# Altium schematic sheet DM1097_TopLevel.SchDoc: =project_title
size Tabloid; PageSetup: Record=PageOptions|CenterHorizontal=True|CenterVertical=True|PrintScale=0.73|XCorrection=1.00|YCorrection=1.00|PrintKind=0|BorderSize=5000000|LeftOffset=0|BottomOffset=0|Orientation=2|PaperLength=1000|PaperWidth=1000|Scale=100|PaperSource=7|PrintQuality=-4|MediaType=1|DitherType=10|PaperKind=A4|PrintScaleMode=1; CompanyName: Luxonis Holding; Organization: Luxonis Holding; Address1: 1925 Harmony Park Drive; Address2: Westminster, CO; Address3: 80234; Address4: United States; SheetNumber: 2; SheetTotal: 17
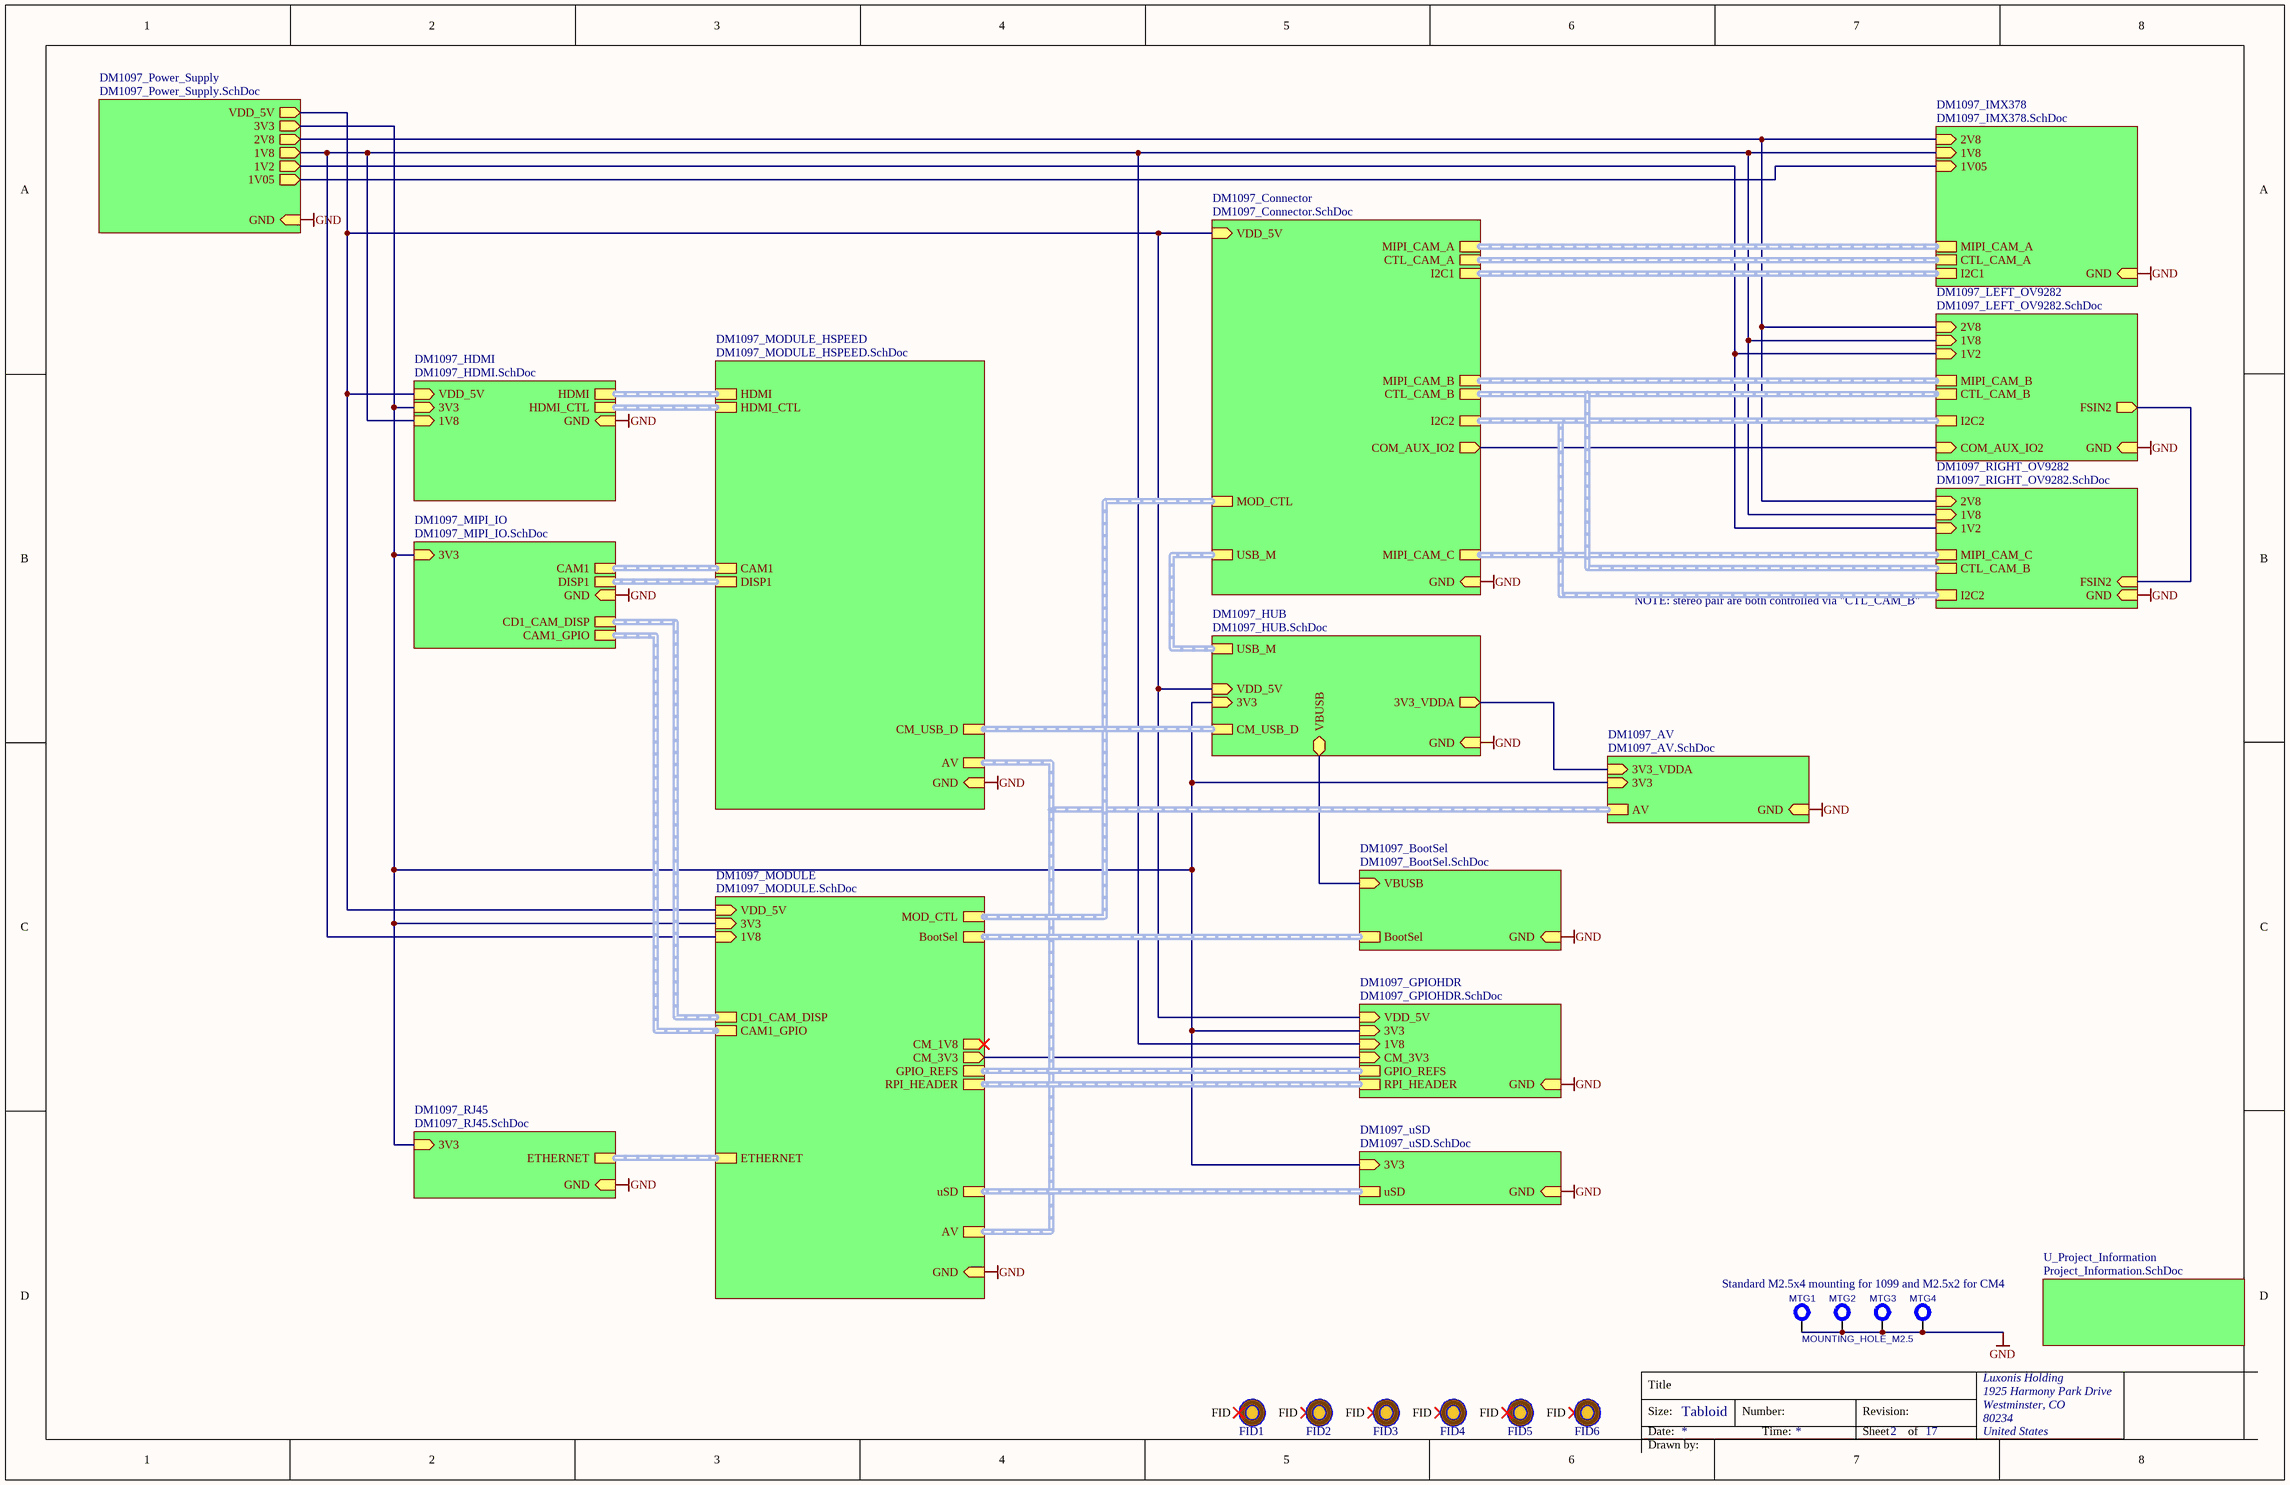
[diagram p0: DM1097_TopLevel.SchDoc]

## Parts
FID1  FIDUCIAL_ROUND_1MM  [FIDUCIAL_ROUND_1MM]  (value not drawn)  (no BOM)
FID2  FIDUCIAL_ROUND_1MM  [FIDUCIAL_ROUND_1MM]  (value not drawn)  (no BOM)
FID3  FIDUCIAL_ROUND_1MM  [FIDUCIAL_ROUND_1MM]  (value not drawn)  (no BOM)
FID4  FIDUCIAL_ROUND_1MM  [FIDUCIAL_ROUND_1MM]  (value not drawn)  (no BOM)
FID5  FIDUCIAL_ROUND_1MM  [FIDUCIAL_ROUND_1MM]  (value not drawn)  (no BOM)
FID6  FIDUCIAL_ROUND_1MM  [FIDUCIAL_ROUND_1MM]  (value not drawn)  (no BOM)
MTG1  MOUNTING_HOLE_M2.5  [MOUNTING_HOLE_M2.5]  (value not drawn)  (no BOM)
MTG2  MOUNTING_HOLE_M2.5  [MOUNTING_HOLE_M2.5]  (value not drawn)  (no BOM)
MTG3  MOUNTING_HOLE_M2.5  [MOUNTING_HOLE_M2.5]  (value not drawn)  (no BOM)
MTG4  MOUNTING_HOLE_M2.5  [MOUNTING_HOLE_M2.5]  (no BOM)

## Sub-sheets
DM1097_AV = DM1097_AV.SchDoc: AV (harness AV), 3V3 (in), GND (in), 3V3_VDDA (in)
DM1097_BootSel = DM1097_BootSel.SchDoc: VBUSB (in), BootSel (harness BootSel), GND (in)
DM1097_Connector = DM1097_Connector.SchDoc: MIPI_CAM_B (harness MIPI_CAM_B), MIPI_CAM_A (harness MIPI_CAM_A), MIPI_CAM_C (harness MIPI_CAM_C), I2C2 (harness I2C2), I2C1 (harness I2C1), CTL_CAM_A (harness CTL_CAM_A), CTL_CAM_B (harness CTL_CAM_B), VDD_5V (in), USB_M (harness USB_M), GND (in), MOD_CTL (harness MOD_CTL), COM_AUX_IO2 (out)
DM1097_GPIOHDR = DM1097_GPIOHDR.SchDoc: GPIO_REFS (harness GPIO_REFS), RPI_HEADER (harness RPI_HEADER), 3V3 (in), GND (in), VDD_5V (in), 1V8 (in), CM_3V3 (in)
DM1097_HDMI = DM1097_HDMI.SchDoc: HDMI_CTL (harness HDMI_CTL), HDMI (harness HDMI), 3V3 (in), GND (in), VDD_5V (in), 1V8 (in)
DM1097_HUB = DM1097_HUB.SchDoc: CM_USB_D (harness CM _USB_D), USB_M (harness USB_M), VDD_5V (in), 3V3 (in), GND (in), 3V3_VDDA (out), VBUSB (bidir)
DM1097_IMX378 = DM1097_IMX378.SchDoc: 2V8 (in), 1V05 (in), I2C1 (harness I2C1), MIPI_CAM_A (harness MIPI_CAM_A), CTL_CAM_A (harness CTL_CAM_A), GND (in), 1V8 (in)
DM1097_LEFT_OV9282 = DM1097_LEFT_OV9282.SchDoc: I2C2 (harness I2C2), CTL_CAM_B (harness CTL_CAM_B), MIPI_CAM_B (harness MIPI_CAM_B), 1V2 (in), 2V8 (in), GND (in), 1V8 (in), FSIN2 (out), COM_AUX_IO2 (in)
DM1097_MIPI_IO = DM1097_MIPI_IO.SchDoc: 3V3 (in), GND (in), DISP1 (harness DISP1), CAM1 (harness CAM1), CD1_CAM_DISP (harness CD1_CAM_DISP), CAM1_GPIO (harness CAM1)
DM1097_MODULE = DM1097_MODULE.SchDoc: GPIO_REFS (harness GPIO_REFS), GND (in), RPI_HEADER (harness RPI_HEADER), 3V3 (in), AV (harness AV), VDD_5V (in), BootSel (harness BootSel), CM_3V3 (out), uSD (harness uSD), ETHERNET (harness ETHERNET), CM_1V8 (out), MOD_CTL, 1V8 (in), CAM1_GPIO, CD1_CAM_DISP
DM1097_MODULE_HSPEED = DM1097_MODULE_HSPEED.SchDoc: HDMI (harness HDMI), HDMI_CTL (harness HDMI_CTL), GND (in), DISP1 (harness DISP1), CAM1 (harness CAM1), AV (harness AV), CM_USB_D
DM1097_Power_Supply = DM1097_Power_Supply.SchDoc: 1V8 (out), 2V8 (out), 1V05 (out), VDD_5V (out), GND (in), 3V3 (out), 1V2 (out)
DM1097_RIGHT_OV9282 = DM1097_RIGHT_OV9282.SchDoc: I2C2 (harness I2C2), 1V2 (in), 2V8 (in), GND (in), 1V8 (in), FSIN2 (in), MIPI_CAM_C (harness MIPI_CAM_C), CTL_CAM_B (harness CTL_CAM_B)
DM1097_RJ45 = DM1097_RJ45.SchDoc: 3V3 (in), ETHERNET (harness ETHERNET), GND (in)
DM1097_uSD = DM1097_uSD.SchDoc: uSD (harness uSD), 3V3 (in), GND (in)
U_Project_Information = Project_Information.SchDoc: no entries

## Nets
GND: MTG1.1 MTG2.1 MTG3.1 MTG4.1 ; sheet DM1097_IMX378/GND, sheet DM1097_Connector/GND, sheet DM1097_MODULE/GND, sheet DM1097_uSD/GND, sheet DM1097_BootSel/GND, sheet DM1097_GPIOHDR/GND, sheet DM1097_HUB/GND, sheet DM1097_RJ45/GND, sheet DM1097_MIPI_IO/GND, sheet DM1097_AV/GND, sheet DM1097_RIGHT_OV9282/GND, sheet DM1097_LEFT_OV9282/GND, sheet DM1097_Power_Supply/GND, sheet DM1097_HDMI/GND, sheet DM1097_MODULE_HSPEED/GND
(unnamed): sheet DM1097_IMX378/2V8, sheet DM1097_RIGHT_OV9282/2V8, sheet DM1097_LEFT_OV9282/2V8, sheet DM1097_Power_Supply/2V8
(unnamed): sheet DM1097_IMX378/1V05, sheet DM1097_Power_Supply/1V05
(unnamed): sheet DM1097_IMX378/1V8, sheet DM1097_MODULE/1V8, sheet DM1097_GPIOHDR/1V8, sheet DM1097_RIGHT_OV9282/1V8, sheet DM1097_LEFT_OV9282/1V8, sheet DM1097_Power_Supply/1V8, sheet DM1097_HDMI/1V8
(unnamed): sheet DM1097_Connector/VDD_5V, sheet DM1097_MODULE/VDD_5V, sheet DM1097_GPIOHDR/VDD_5V, sheet DM1097_HUB/VDD_5V, sheet DM1097_Power_Supply/VDD_5V, sheet DM1097_HDMI/VDD_5V
(unnamed): sheet DM1097_Connector/COM_AUX_IO2, sheet DM1097_LEFT_OV9282/COM_AUX_IO2
(unnamed): sheet DM1097_MODULE/3V3, sheet DM1097_uSD/3V3, sheet DM1097_GPIOHDR/3V3, sheet DM1097_HUB/3V3, sheet DM1097_RJ45/3V3, sheet DM1097_MIPI_IO/3V3, sheet DM1097_AV/3V3, sheet DM1097_Power_Supply/3V3, sheet DM1097_HDMI/3V3
(unnamed): sheet DM1097_MODULE/CM_3V3, sheet DM1097_GPIOHDR/CM_3V3
(unnamed): sheet DM1097_BootSel/VBUSB, sheet DM1097_HUB/VBUSB
(unnamed): sheet DM1097_HUB/3V3_VDDA, sheet DM1097_AV/3V3_VDDA
(unnamed): sheet DM1097_RIGHT_OV9282/1V2, sheet DM1097_LEFT_OV9282/1V2, sheet DM1097_Power_Supply/1V2
(unnamed): sheet DM1097_RIGHT_OV9282/FSIN2, sheet DM1097_LEFT_OV9282/FSIN2

Not connected (* = marked no-connect by the designer): FID1 FID*; FID2 FID*; FID3 FID*; FID4 FID*; FID5 FID*; FID6 FID*

## Buses and harness runs
harness sheet DM1097_AV/AV = sheet DM1097_MODULE/AV = sheet DM1097_MODULE_HSPEED/AV
harness sheet DM1097_BootSel/BootSel = sheet DM1097_MODULE/BootSel
harness sheet DM1097_Connector/CTL_CAM_A = sheet DM1097_IMX378/CTL_CAM_A
harness sheet DM1097_Connector/CTL_CAM_B = sheet DM1097_LEFT_OV9282/CTL_CAM_B = sheet DM1097_RIGHT_OV9282/CTL_CAM_B
harness sheet DM1097_Connector/I2C1 = sheet DM1097_IMX378/I2C1
harness sheet DM1097_Connector/I2C2 = sheet DM1097_LEFT_OV9282/I2C2 = sheet DM1097_RIGHT_OV9282/I2C2
harness sheet DM1097_Connector/MIPI_CAM_A = sheet DM1097_IMX378/MIPI_CAM_A
harness sheet DM1097_Connector/MIPI_CAM_B = sheet DM1097_LEFT_OV9282/MIPI_CAM_B
harness sheet DM1097_Connector/MIPI_CAM_C = sheet DM1097_RIGHT_OV9282/MIPI_CAM_C
harness sheet DM1097_Connector/MOD_CTL = sheet DM1097_MODULE/MOD_CTL
harness sheet DM1097_Connector/USB_M = sheet DM1097_HUB/USB_M
harness sheet DM1097_GPIOHDR/GPIO_REFS = sheet DM1097_MODULE/GPIO_REFS
harness sheet DM1097_GPIOHDR/RPI_HEADER = sheet DM1097_MODULE/RPI_HEADER
harness sheet DM1097_HDMI/HDMI = sheet DM1097_MODULE_HSPEED/HDMI
harness sheet DM1097_HDMI/HDMI_CTL = sheet DM1097_MODULE_HSPEED/HDMI_CTL
harness sheet DM1097_HUB/CM_USB_D = sheet DM1097_MODULE_HSPEED/CM_USB_D
harness sheet DM1097_MIPI_IO/CAM1 = sheet DM1097_MODULE_HSPEED/CAM1
harness sheet DM1097_MIPI_IO/CAM1_GPIO = sheet DM1097_MODULE/CAM1_GPIO
harness sheet DM1097_MIPI_IO/CD1_CAM_DISP = sheet DM1097_MODULE/CD1_CAM_DISP
harness sheet DM1097_MIPI_IO/DISP1 = sheet DM1097_MODULE_HSPEED/DISP1
harness sheet DM1097_MODULE/ETHERNET = sheet DM1097_RJ45/ETHERNET
harness sheet DM1097_MODULE/uSD = sheet DM1097_uSD/uSD

## Notes on the sheet
- NOTE: stereo pair are both controlled via "CTL_CAM_B"
- Standard M2.5x4 mounting for 1099 and M2.5x2 for CM4
- Title
- Size:
- Date:
- Tabloid
- Number:
- Time:
- Revision:
- Sheet
- of
- Drawn by:

## Library data of the parts
FID1-FID6 = FIDUCIAL: Fiducial with various available footprints
MTG1-MTG4 = MP_Mounting-Holes: =CurrentFootprint; B - Value: Not a Part; A - Level: 0